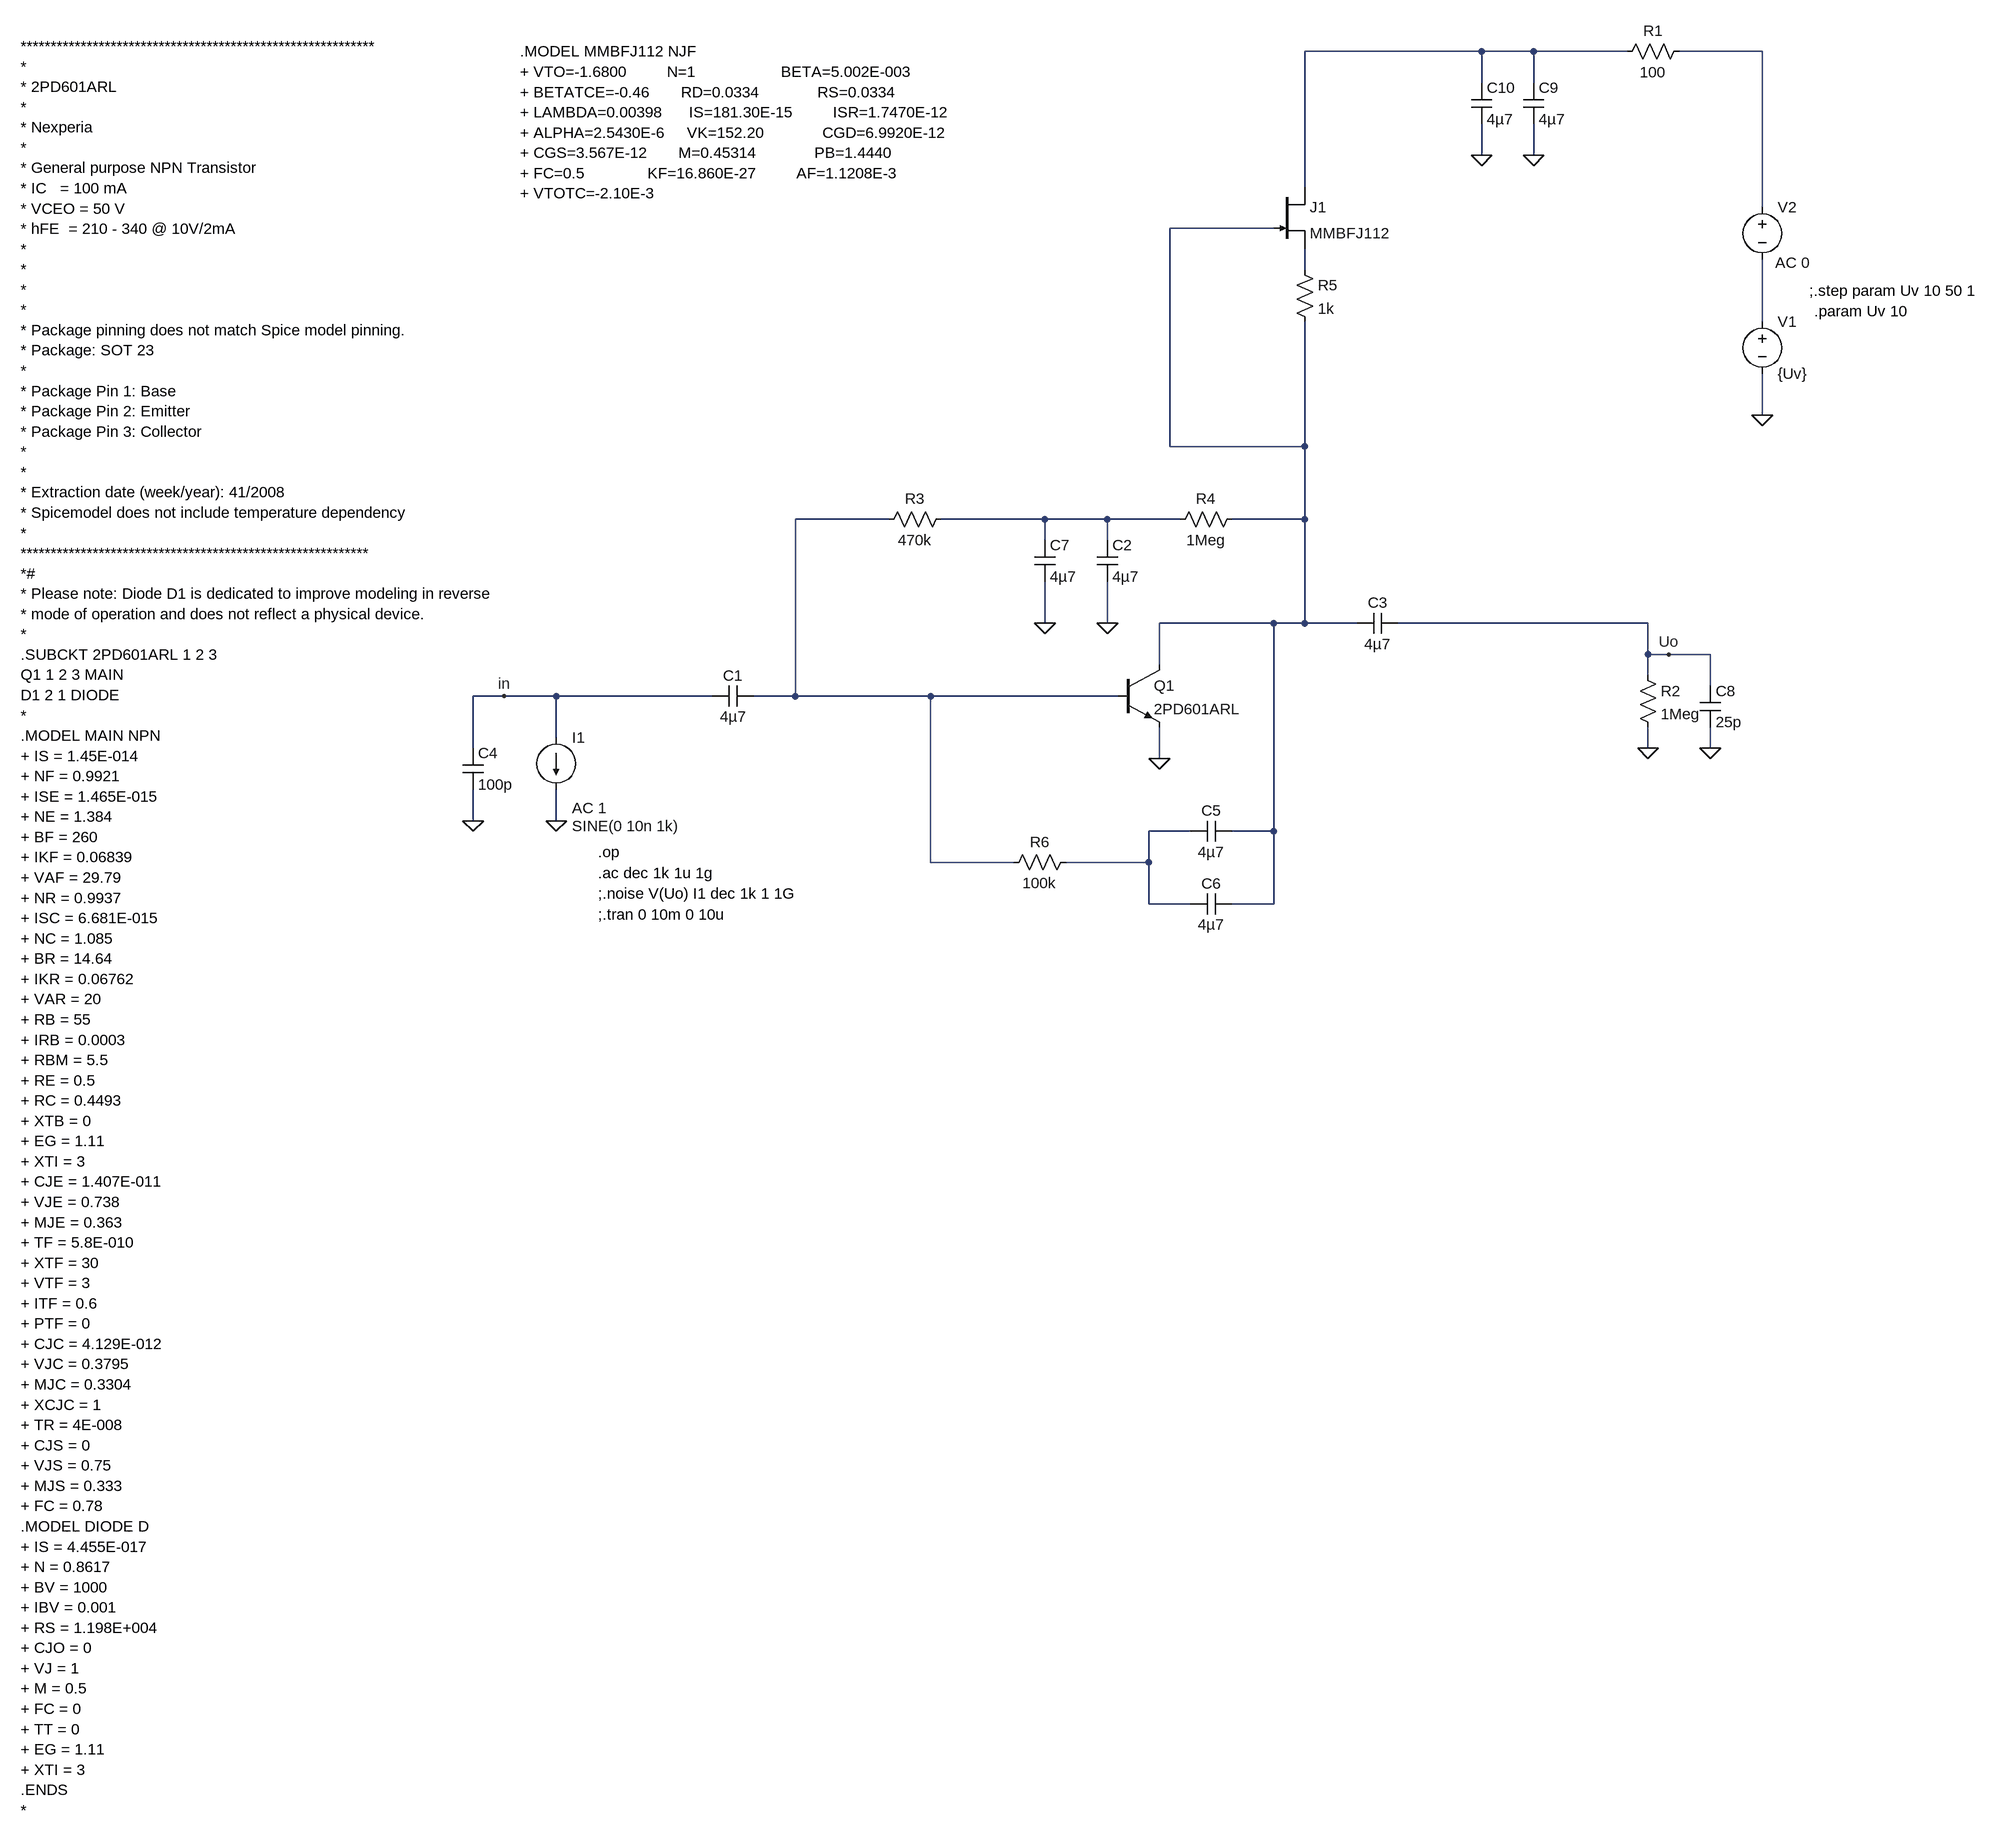
[diagram p0: schematic v1.2.asc]
v1.2.asc, the LTspice schematic file:
Version 4
SHEET 1 1828 2076
WIRE 896 -816 624 -816
WIRE 976 -816 896 -816
WIRE 1120 -816 976 -816
WIRE 1328 -816 1200 -816
WIRE 896 -768 896 -816
WIRE 976 -768 976 -816
WIRE 896 -656 896 -704
WIRE 976 -656 976 -704
WIRE 624 -608 624 -816
WIRE 1328 -576 1328 -816
WIRE 576 -544 416 -544
WIRE 624 -480 624 -512
WIRE 1328 -400 1328 -496
WIRE 1328 -256 1328 -320
WIRE 416 -208 416 -544
WIRE 624 -208 624 -400
WIRE 624 -208 416 -208
WIRE -16 -96 -160 -96
WIRE 224 -96 64 -96
WIRE 320 -96 224 -96
WIRE 432 -96 320 -96
WIRE 624 -96 624 -208
WIRE 624 -96 512 -96
WIRE 224 -64 224 -96
WIRE 320 -64 320 -96
WIRE 224 64 224 0
WIRE 320 64 320 0
WIRE 576 64 400 64
WIRE 624 64 624 -96
WIRE 624 64 576 64
WIRE 704 64 624 64
WIRE 1152 64 768 64
WIRE 1152 112 1152 64
WIRE 1184 112 1152 112
WIRE 1248 112 1184 112
WIRE 400 128 400 64
WIRE 1152 144 1152 112
WIRE 1248 160 1248 112
WIRE -608 176 -656 176
WIRE -528 176 -608 176
WIRE -288 176 -528 176
WIRE -160 176 -160 -96
WIRE -160 176 -224 176
WIRE 48 176 -160 176
WIRE 336 176 48 176
WIRE -528 240 -528 176
WIRE -656 256 -656 176
WIRE 1152 256 1152 224
WIRE 1248 256 1248 224
WIRE 400 272 400 224
WIRE -656 368 -656 320
WIRE -528 368 -528 320
WIRE 448 384 384 384
WIRE 576 384 576 64
WIRE 576 384 512 384
WIRE 48 432 48 176
WIRE 176 432 48 432
WIRE 384 432 384 384
WIRE 384 432 256 432
WIRE 384 496 384 432
WIRE 448 496 384 496
WIRE 576 496 576 384
WIRE 576 496 512 496
FLAG 400 272 0
FLAG 1152 256 0
FLAG 1184 112 Uo
FLAG 320 64 0
FLAG 1328 -256 0
FLAG -528 368 0
FLAG -656 368 0
FLAG 224 64 0
FLAG 1248 256 0
FLAG 896 -656 0
FLAG 976 -656 0
FLAG -608 176 in
DATAFLAG 224 176 ""
DATAFLAG 480 64 ""
DATAFLAG 912 64 ""
DATAFLAG 704 -816 "$-V(N003)"
DATAFLAG 480 -544 "$-V(N003)"
SYMBOL npn 336 128 R0
SYMATTR InstName Q1
SYMATTR Value 2PD601ARL
SYMATTR Prefix X
SYMBOL res 1136 128 R0
SYMATTR InstName R2
SYMATTR Value 1Meg
SYMBOL cap -224 160 R90
WINDOW 0 0 32 VBottom 2
WINDOW 3 32 32 VTop 2
SYMATTR InstName C1
SYMATTR Value 4µ7
SYMBOL res 80 -112 R90
WINDOW 0 0 56 VBottom 2
WINDOW 3 32 56 VTop 2
SYMATTR InstName R3
SYMATTR Value 470k
SYMBOL res 528 -112 R90
WINDOW 0 0 56 VBottom 2
WINDOW 3 32 56 VTop 2
SYMATTR InstName R4
SYMATTR Value 1Meg
SYMBOL cap 304 -64 R0
SYMATTR InstName C2
SYMATTR Value 4µ7
SYMBOL cap 768 48 R90
WINDOW 0 0 32 VBottom 2
WINDOW 3 32 32 VTop 2
SYMATTR InstName C3
SYMATTR Value 4µ7
SYMBOL njf 576 -608 R0
SYMATTR InstName J1
SYMATTR Value MMBFJ112
SYMBOL res 608 -496 R0
SYMATTR InstName R5
SYMATTR Value 1k
SYMBOL voltage 1328 -416 R0
WINDOW 123 0 0 Left 0
WINDOW 39 0 0 Left 0
SYMATTR InstName V1
SYMATTR Value {Uv}
SYMBOL current -528 240 R0
WINDOW 3 24 136 Left 2
WINDOW 123 24 108 Left 2
WINDOW 39 0 0 Left 0
SYMATTR Value SINE(0 10n 1k)
SYMATTR Value2 AC 1
SYMATTR InstName I1
SYMBOL cap -672 256 R0
SYMATTR InstName C4
SYMATTR Value 100p
SYMBOL res 272 416 R90
WINDOW 0 0 56 VBottom 2
WINDOW 3 32 56 VTop 2
SYMATTR InstName R6
SYMATTR Value 100k
SYMBOL cap 512 368 R90
WINDOW 0 0 32 VBottom 2
WINDOW 3 32 32 VTop 2
SYMATTR InstName C5
SYMATTR Value 4µ7
SYMBOL cap 512 480 R90
WINDOW 0 0 32 VBottom 2
WINDOW 3 32 32 VTop 2
SYMATTR InstName C6
SYMATTR Value 4µ7
SYMBOL cap 208 -64 R0
SYMATTR InstName C7
SYMATTR Value 4µ7
SYMBOL cap 1232 160 R0
SYMATTR InstName C8
SYMATTR Value 25p
SYMBOL res 1216 -832 R90
WINDOW 0 0 56 VBottom 2
WINDOW 3 32 56 VTop 2
SYMATTR InstName R1
SYMATTR Value 100
SYMBOL cap 960 -768 R0
SYMATTR InstName C9
SYMATTR Value 4µ7
SYMBOL cap 880 -768 R0
SYMATTR InstName C10
SYMATTR Value 4µ7
SYMBOL voltage 1328 -592 R0
WINDOW 3 24 96 Invisible 2
WINDOW 123 20 101 Left 2
WINDOW 39 0 0 Left 0
SYMATTR Value 0
SYMATTR Value2 AC 0
SYMATTR InstName V2
TEXT -464 416 Left 2 !.op
TEXT -464 448 Left 2 !.ac dec 1k 1u 1g
TEXT 1400 -448 Left 2 !;.step param Uv 10 50 1
TEXT 1408 -416 Left 2 !.param Uv 10
TEXT -464 480 Left 2 !;.noise V(Uo) I1 dec 1k 1 1G
TEXT -584 -816 Left 2 !.MODEL MMBFJ112 NJF\n+ VTO=-1.6800         N=1                   BETA=5.002E-003\n+ BETATCE=-0.46       RD=0.0334             RS=0.0334                  \n+ LAMBDA=0.00398      IS=181.30E-15         ISR=1.7470E-12\n+ ALPHA=2.5430E-6     VK=152.20             CGD=6.9920E-12          \n+ CGS=3.567E-12       M=0.45314             PB=1.4440  \n+ FC=0.5              KF=16.860E-27         AF=1.1208E-3        \n+ VTOTC=-2.10E-3
TEXT -1352 -824 Left 2 !***********************************************************\n*\n* 2PD601ARL\n*\n* Nexperia\n*\n* General purpose NPN Transistor\n* IC   = 100 mA\n* VCEO = 50 V \n* hFE  = 210 - 340 @ 10V/2mA\n*\n*\n*\n*\n* Package pinning does not match Spice model pinning.\n* Package: SOT 23\n* \n* Package Pin 1: Base\n* Package Pin 2: Emitter\n* Package Pin 3: Collector\n*\n*\n* Extraction date (week/year): 41/2008  \n* Spicemodel does not include temperature dependency\n*\n**********************************************************\n*#\n* Please note: Diode D1 is dedicated to improve modeling in reverse\n* mode of operation and does not reflect a physical device.\n*\n.SUBCKT 2PD601ARL 1 2 3\nQ1 1 2 3 MAIN\nD1 2 1 DIODE\n*\n.MODEL MAIN NPN \n+ IS = 1.45E-014 \n+ NF = 0.9921 \n+ ISE = 1.465E-015 \n+ NE = 1.384 \n+ BF = 260 \n+ IKF = 0.06839 \n+ VAF = 29.79 \n+ NR = 0.9937 \n+ ISC = 6.681E-015 \n+ NC = 1.085 \n+ BR = 14.64 \n+ IKR = 0.06762 \n+ VAR = 20 \n+ RB = 55 \n+ IRB = 0.0003 \n+ RBM = 5.5 \n+ RE = 0.5 \n+ RC = 0.4493 \n+ XTB = 0 \n+ EG = 1.11 \n+ XTI = 3 \n+ CJE = 1.407E-011 \n+ VJE = 0.738 \n+ MJE = 0.363 \n+ TF = 5.8E-010 \n+ XTF = 30 \n+ VTF = 3 \n+ ITF = 0.6 \n+ PTF = 0 \n+ CJC = 4.129E-012 \n+ VJC = 0.3795 \n+ MJC = 0.3304 \n+ XCJC = 1 \n+ TR = 4E-008 \n+ CJS = 0 \n+ VJS = 0.75 \n+ MJS = 0.333 \n+ FC = 0.78 \n.MODEL DIODE D \n+ IS = 4.455E-017 \n+ N = 0.8617 \n+ BV = 1000 \n+ IBV = 0.001 \n+ RS = 1.198E+004 \n+ CJO = 0 \n+ VJ = 1 \n+ M = 0.5 \n+ FC = 0 \n+ TT = 0 \n+ EG = 1.11 \n+ XTI = 3 \n.ENDS\n*
TEXT -464 512 Left 2 !;.tran 0 10m 0 10u

The netlist it stands for:
* v1.2.asc
XQ1 N003 N006 0 2PD601ARL  ; pins C B E
R2 Uo 0 1Meg
C1 N006 in 4µ7
R3 N007 N006 470k
R4 N003 N007 1Meg
C2 N007 0 4µ7
C3 Uo N003 4µ7
J1 N001 N003 N004 MMBFJ112
R5 N004 N003 1k
V1 N005 0 {Uv}
I1 in 0 SINE(0 10n 1k) AC 1
C4 in 0 100p
R6 N008 N006 100k
C5 N003 N008 4µ7
C6 N003 N008 4µ7
C7 N007 0 4µ7
C8 Uo 0 25p
R1 N002 N001 100
C9 N001 0 4µ7
C10 N001 0 4µ7
V2 N002 N005 0 AC 0
.model NJF NJF
.model PJF PJF
.lib standard.jft
.op
.ac dec 1k 1u 1g
;.step param Uv 10 50 1
.param Uv 10
;.noise V(Uo) I1 dec 1k 1 1G
.MODEL MMBFJ112 NJF
+ VTO=-1.6800         N=1                   BETA=5.002E-003
+ BETATCE=-0.46       RD=0.0334             RS=0.0334
+ LAMBDA=0.00398      IS=181.30E-15         ISR=1.7470E-12
+ ALPHA=2.5430E-6     VK=152.20             CGD=6.9920E-12
+ CGS=3.567E-12       M=0.45314             PB=1.4440
+ FC=0.5              KF=16.860E-27         AF=1.1208E-3
+ VTOTC=-2.10E-3
***********************************************************
*
* 2PD601ARL
*
* Nexperia
*
* General purpose NPN Transistor
* IC   = 100 mA
* VCEO = 50 V
* hFE  = 210 - 340 @ 10V/2mA
*
*
*
*
* Package pinning does not match Spice model pinning.
* Package: SOT 23
*
* Package Pin 1: Base
* Package Pin 2: Emitter
* Package Pin 3: Collector
*
*
* Extraction date (week/year): 41/2008
* Spicemodel does not include temperature dependency
*
**********************************************************
*#
* Please note: Diode D1 is dedicated to improve modeling in reverse
* mode of operation and does not reflect a physical device.
*
.SUBCKT 2PD601ARL 1 2 3
Q1 1 2 3 MAIN
D1 2 1 DIODE
*
.MODEL MAIN NPN
+ IS = 1.45E-014
+ NF = 0.9921
+ ISE = 1.465E-015
+ NE = 1.384
+ BF = 260
+ IKF = 0.06839
+ VAF = 29.79
+ NR = 0.9937
+ ISC = 6.681E-015
+ NC = 1.085
+ BR = 14.64
+ IKR = 0.06762
+ VAR = 20
+ RB = 55
+ IRB = 0.0003
+ RBM = 5.5
+ RE = 0.5
+ RC = 0.4493
+ XTB = 0
+ EG = 1.11
+ XTI = 3
+ CJE = 1.407E-011
+ VJE = 0.738
+ MJE = 0.363
+ TF = 5.8E-010
+ XTF = 30
+ VTF = 3
+ ITF = 0.6
+ PTF = 0
+ CJC = 4.129E-012
+ VJC = 0.3795
+ MJC = 0.3304
+ XCJC = 1
+ TR = 4E-008
+ CJS = 0
+ VJS = 0.75
+ MJS = 0.333
+ FC = 0.78
.MODEL DIODE D
+ IS = 4.455E-017
+ N = 0.8617
+ BV = 1000
+ IBV = 0.001
+ RS = 1.198E+004
+ CJO = 0
+ VJ = 1
+ M = 0.5
+ FC = 0
+ TT = 0
+ EG = 1.11
+ XTI = 3
.ENDS
*
;.tran 0 10m 0 10u
.backanno
.end